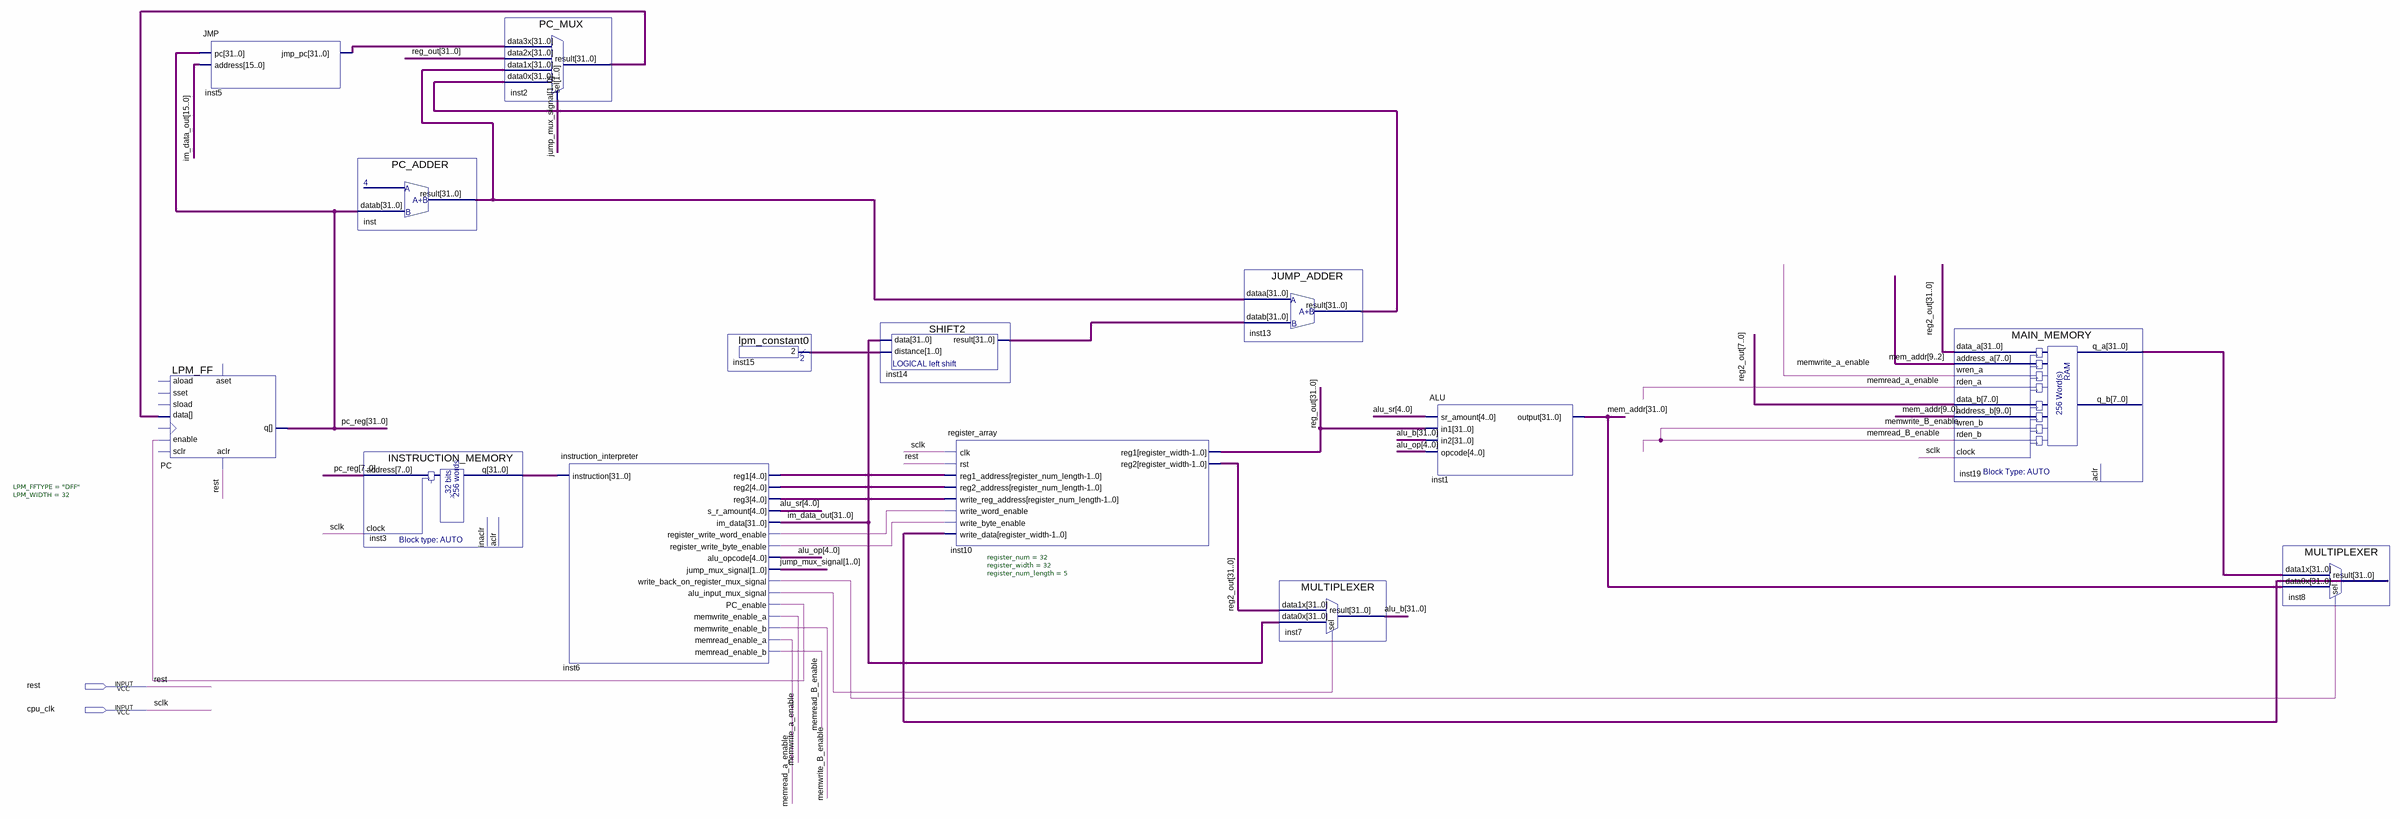
[diagram p0: schematic sheet]
// Quartus schematic CPUProject.bdf as structural Verilog: 14 symbols, 2 pins
module CPUProject (
  input  rest,
  input  cpu_clk
);

  wire inst6_alu_input_mux_signal, inst6_pc_enable, inst6_register_write_byte_enable,
       inst6_register_write_word_enable, inst6_write_back_on_register_mux_signal, memread_a_enable,
       memread_B_enable, memwrite_a_enable;
  wire [1:0] inst15_result, jump_mux_signal;
  wire [4:0] alu_op, alu_sr, inst6_reg1, inst6_reg2, inst6_reg3;
  wire [31:0] alu_b, im_data_out, inst2_result, inst3_q, inst5_jmp_pc, inst8_result, inst13_result,
       inst14_result, inst19_q_a, inst_result, mem_addr, pc_reg, reg2_out, reg_out;

  JMP inst5 (.pc(pc_reg), .address(im_data_out[15:0]), .jmp_pc(inst5_jmp_pc));
  LPM_FF #(.LPM_FFTYPE("DFF"), .LPM_WIDTH(32)) PC (
    .enable(inst6_pc_enable), .aclr(rest), .data(inst2_result), .q(pc_reg));  // open: clock, aload, sset, sload, aset, sclr
  PC_ADDER inst (.datab(pc_reg), .result(inst_result));
  INSTRUCTION_MEMORY inst3 (.address(pc_reg[7:0]), .clock(cpu_clk), .q(inst3_q));  // open: aclr, inaclr
  PC_MUX inst2 (
    .data3x(inst5_jmp_pc), .data2x(reg_out), .data1x(inst_result), .data0x(inst13_result),
    .sel(jump_mux_signal), .result(inst2_result));
  instruction_interpreter inst6 (
    .instruction(inst3_q), .reg1(inst6_reg1), .reg2(inst6_reg2), .reg3(inst6_reg3), .s_r_amount(alu_sr),
    .im_data(im_data_out), .register_write_word_enable(inst6_register_write_word_enable),
    .register_write_byte_enable(inst6_register_write_byte_enable), .alu_opcode(alu_op),
    .jump_mux_signal(jump_mux_signal),
    .write_back_on_register_mux_signal(inst6_write_back_on_register_mux_signal),
    .alu_input_mux_signal(inst6_alu_input_mux_signal), .PC_enable(inst6_pc_enable),
    .memwrite_enable_a(memwrite_a_enable), .memwrite_enable_b(memread_B_enable),
    .memread_enable_a(memread_a_enable), .memread_enable_b(memread_B_enable));
  lpm_constant0 inst15 (.result(inst15_result));
  SHIFT2 inst14 (.data(im_data_out), .distance(inst15_result), .result(inst14_result));
  register_array #(.register_num(32), .register_width(32), .register_num_length(5)) inst10 (
    .clk(cpu_clk), .rst(rest), .reg1_address(inst6_reg1), .reg2_address(inst6_reg2),
    .write_reg_address(inst6_reg3), .write_word_enable(inst6_register_write_word_enable),
    .write_byte_enable(inst6_register_write_byte_enable), .write_data(inst8_result), .reg1(reg_out),
    .reg2(reg2_out));
  JUMP_ADDER inst13 (.dataa(inst_result), .datab(inst14_result), .result(inst13_result));
  MULTIPLEXER inst7 (.data1x(reg2_out), .data0x(im_data_out), .sel(inst6_alu_input_mux_signal), .result(alu_b));
  ALU inst1 (.sr_amount(alu_sr), .in1(reg_out), .in2(alu_b), .opcode(alu_op), .\output (mem_addr));
  MAIN_MEMORY inst19 (
    .data_a(reg2_out), .address_a(mem_addr[9:2]), .wren_a(memwrite_a_enable), .rden_a(memread_a_enable),
    .data_b(reg2_out[7:0]), .address_b(mem_addr[9:0]), .wren_b(memread_B_enable), .rden_b(memread_B_enable),
    .clock(cpu_clk), .q_a(inst19_q_a));  // open: aclr, q_b
  MULTIPLEXER inst8 (
    .data1x(inst19_q_a), .data0x(mem_addr), .sel(inst6_write_back_on_register_mux_signal),
    .result(inst8_result));

  // Other names for the same wires on the sheet: memwrite_B_enable = memread_B_enable; sclk = cpu_clk
endmodule
